# EAGLE schematic Indev v1 (EAGLE 6.3)
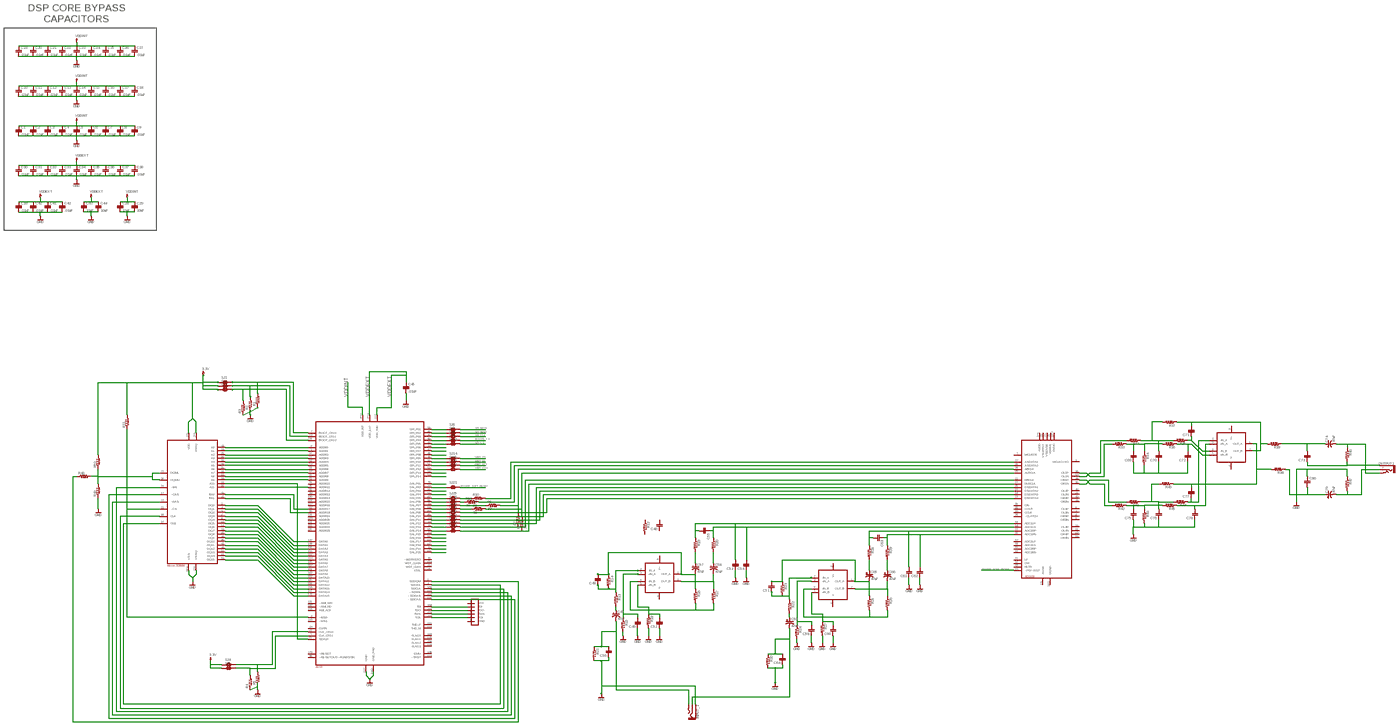
[diagram p0: schematic, sheet 1, overview]
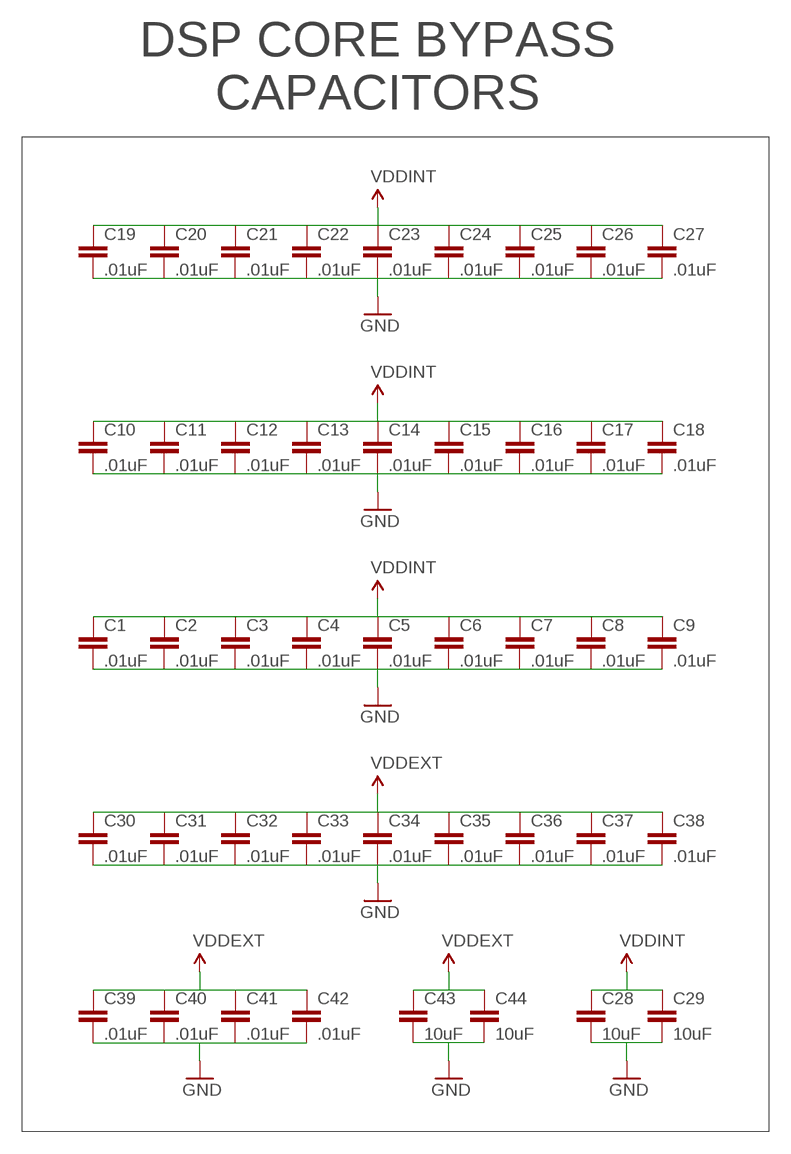
[diagram p1: schematic, sheet 1, part 1 of 4]
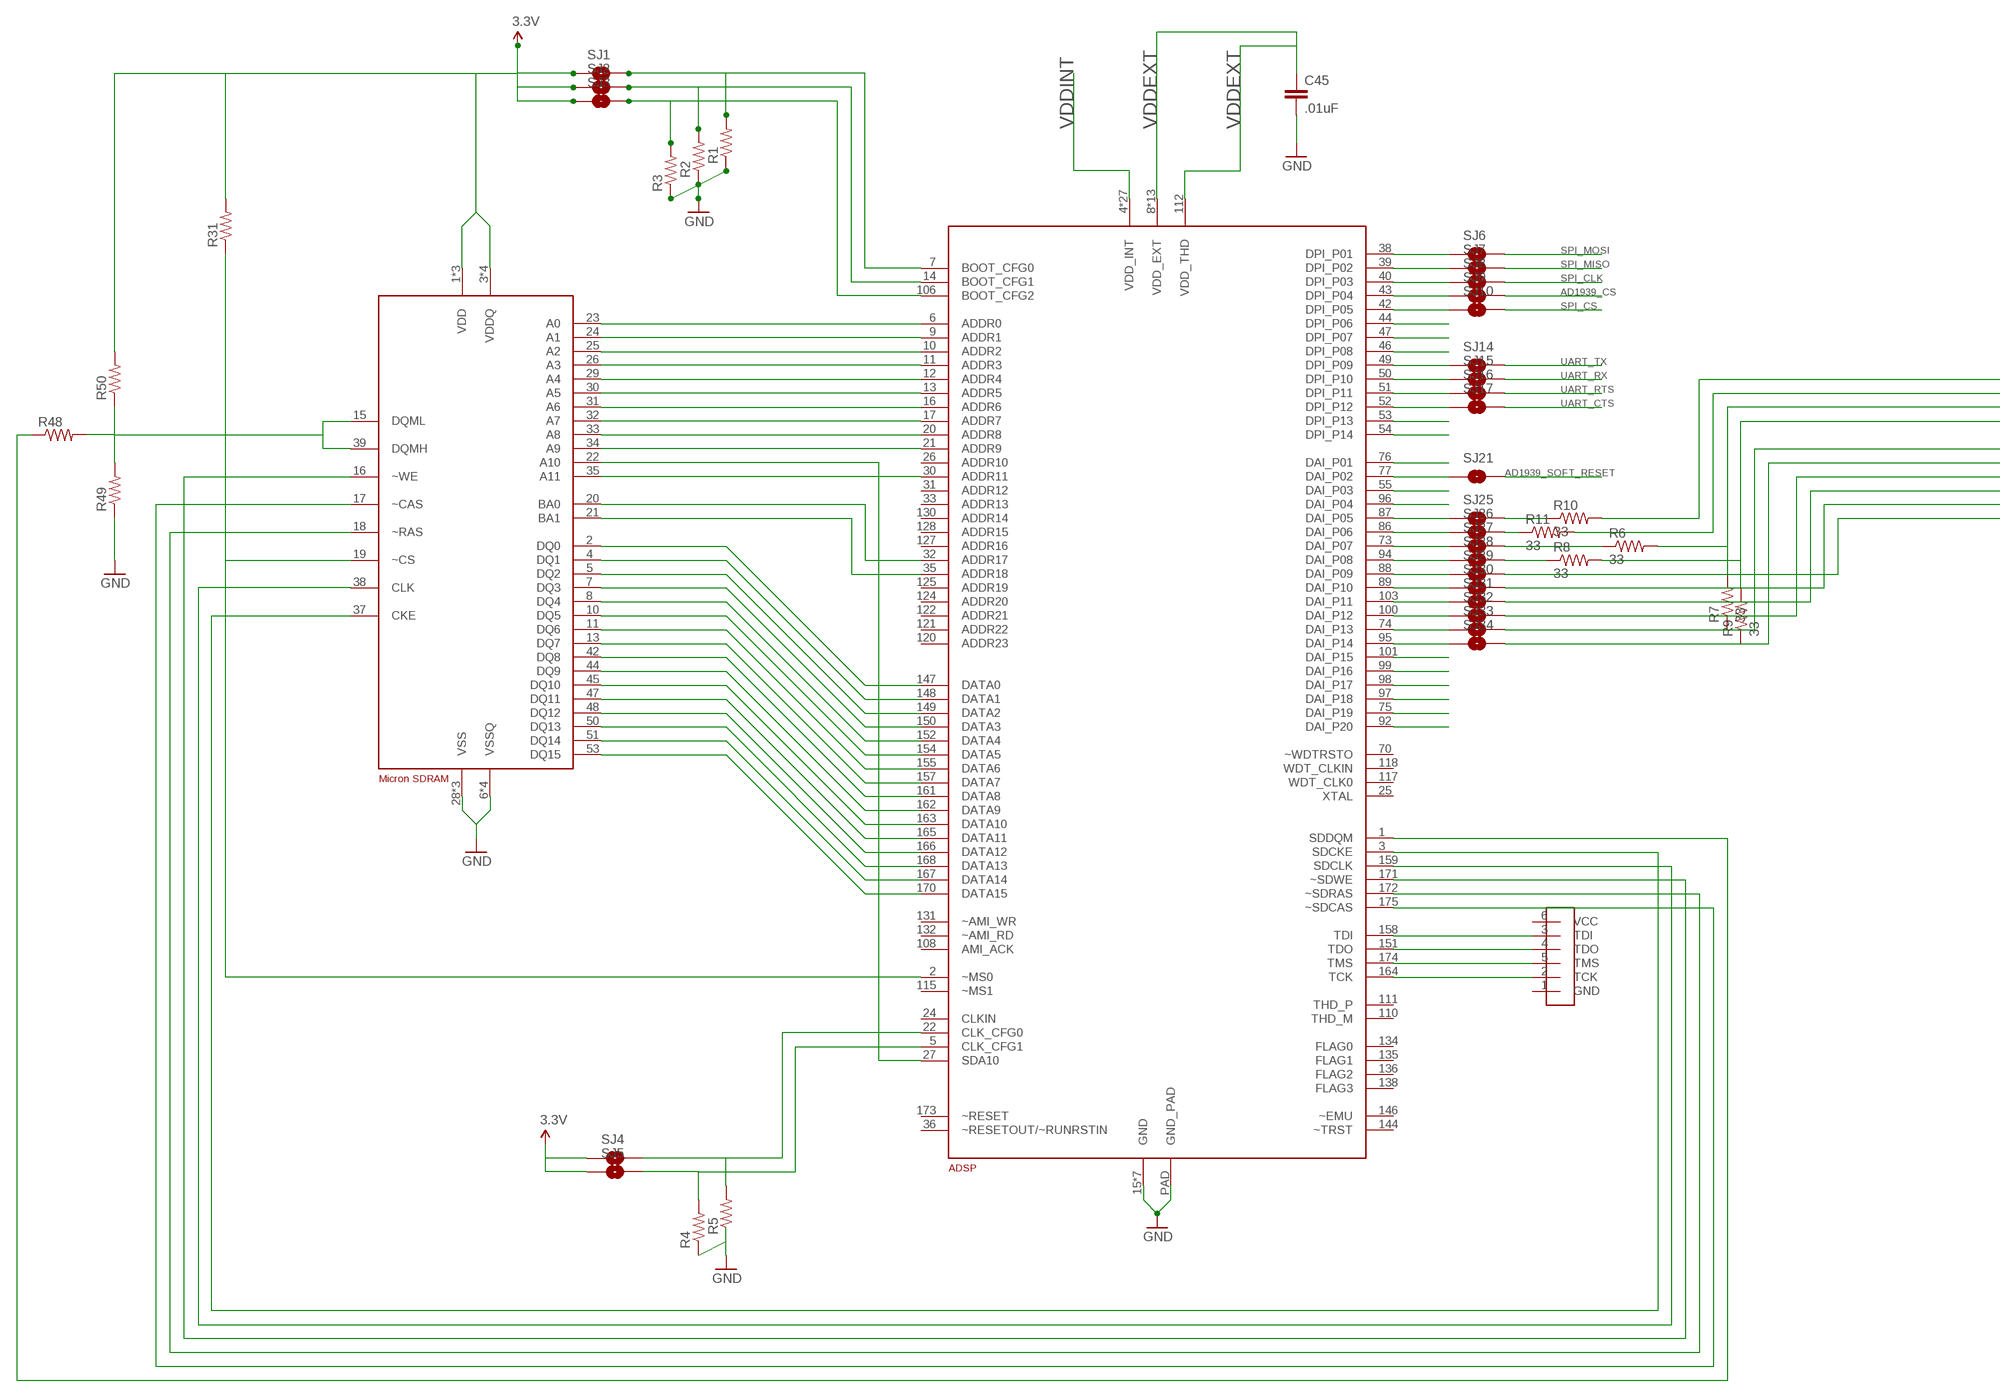
[diagram p2: schematic, sheet 1, part 2 of 4]
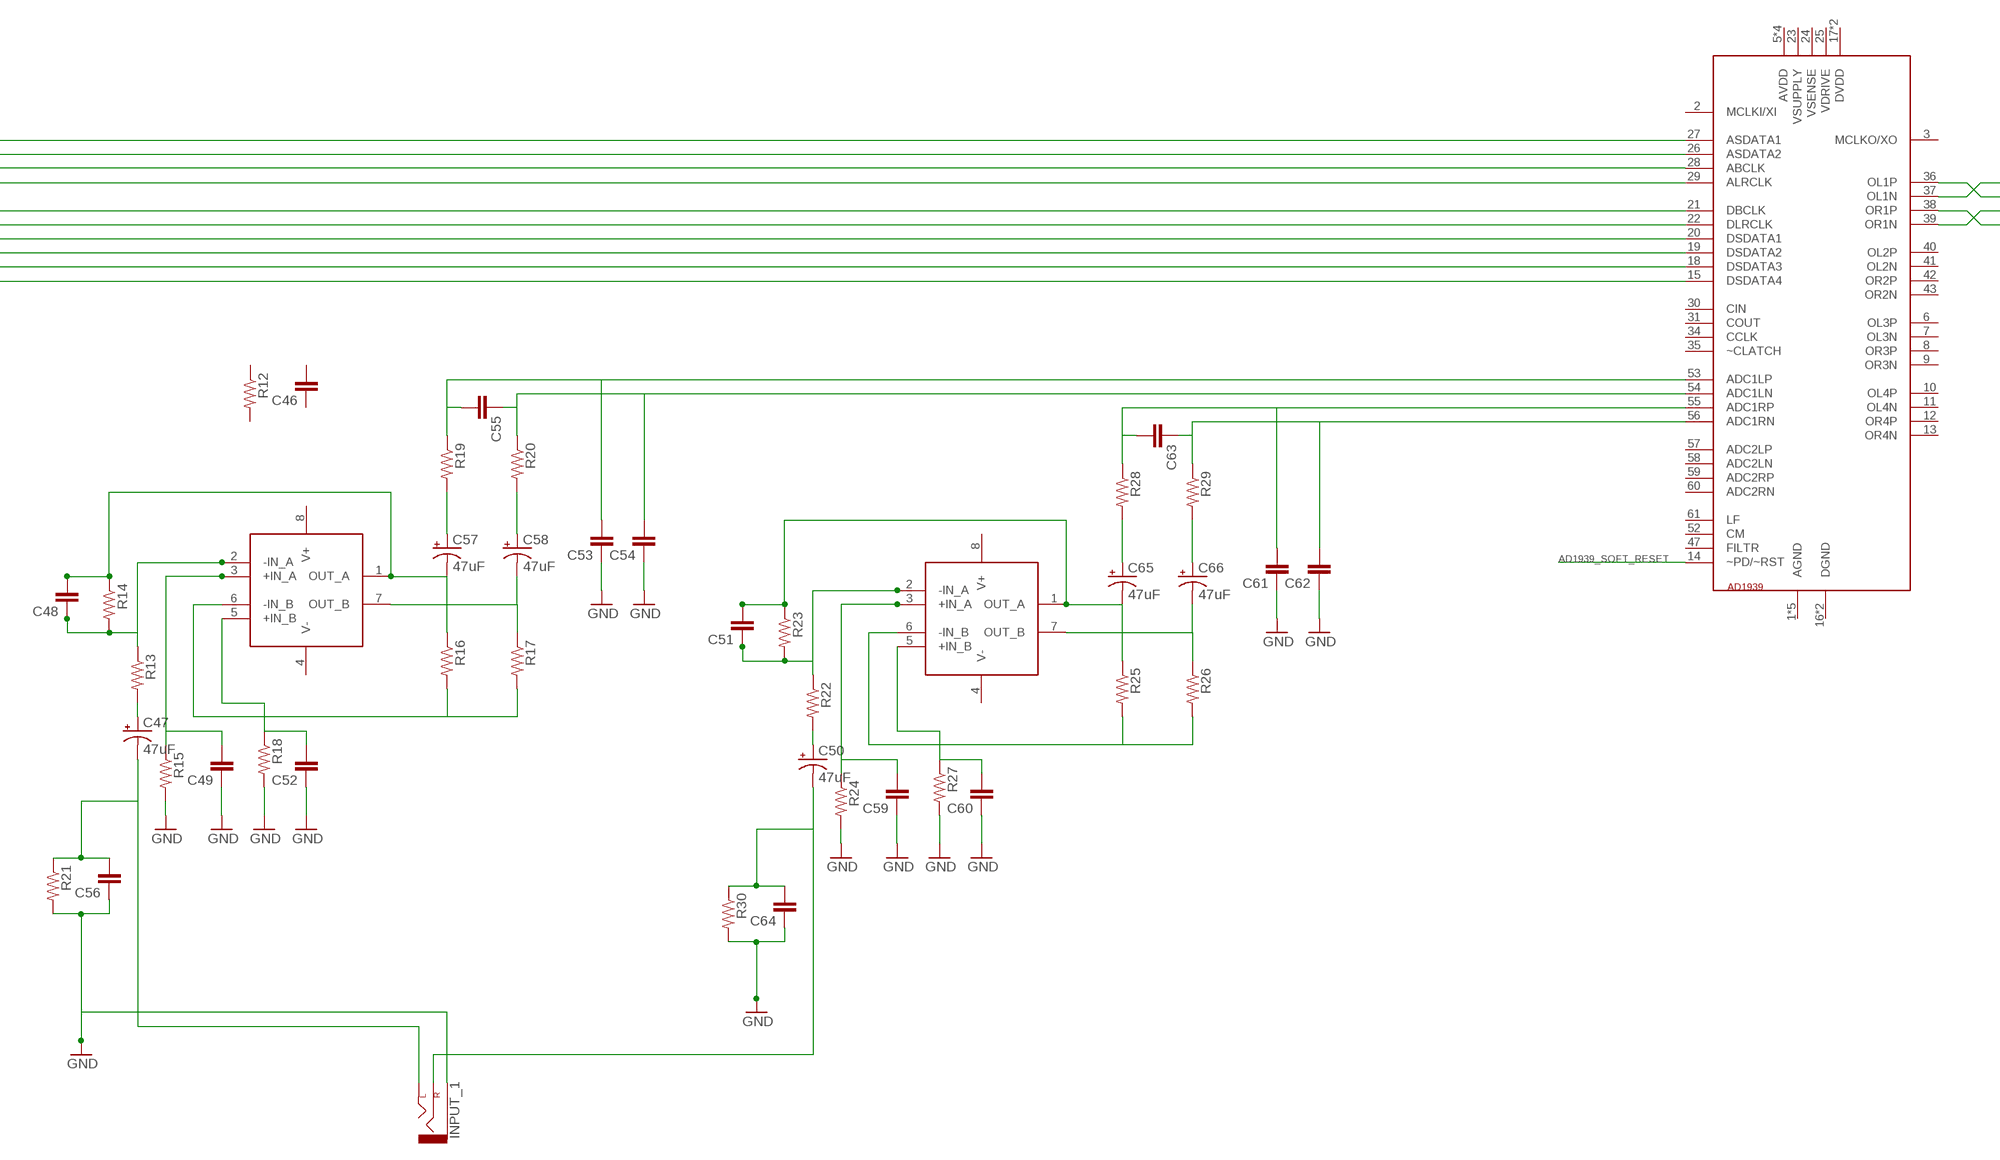
[diagram p3: schematic, sheet 1, part 3 of 4]
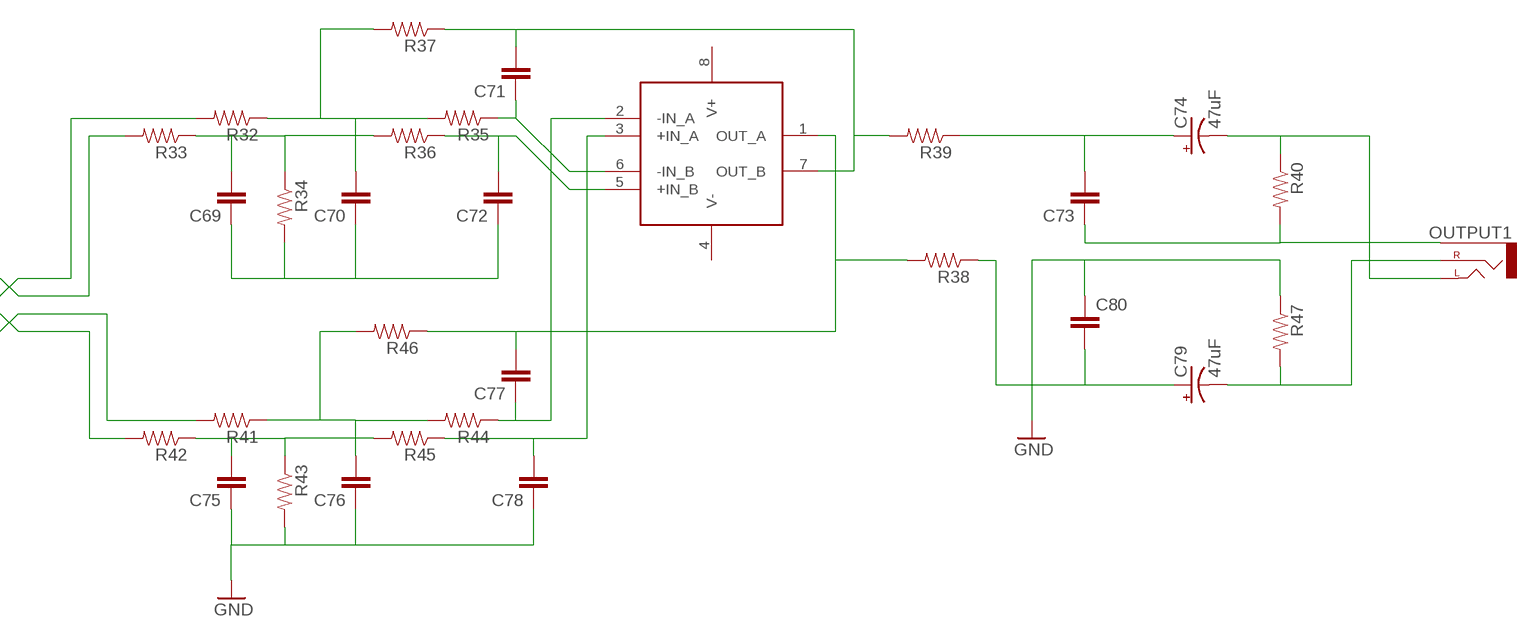
[diagram p4: schematic, sheet 1, part 4 of 4]

## Parts
C1  .01uF  CAP0402-CAP  [0402-CAP]
C2  .01uF  CAP0402-CAP  [0402-CAP]
C3  .01uF  CAP0402-CAP  [0402-CAP]
C4  .01uF  CAP0402-CAP  [0402-CAP]
C5  .01uF  CAP0402-CAP  [0402-CAP]
C6  .01uF  CAP0402-CAP  [0402-CAP]
C7  .01uF  CAP0402-CAP  [0402-CAP]
C8  .01uF  CAP0402-CAP  [0402-CAP]
C9  .01uF  CAP0402-CAP  [0402-CAP]
C10  .01uF  CAP0402-CAP  [0402-CAP]
C11  .01uF  CAP0402-CAP  [0402-CAP]
C12  .01uF  CAP0402-CAP  [0402-CAP]
C13  .01uF  CAP0402-CAP  [0402-CAP]
C14  .01uF  CAP0402-CAP  [0402-CAP]
C15  .01uF  CAP0402-CAP  [0402-CAP]
C16  .01uF  CAP0402-CAP  [0402-CAP]
C17  .01uF  CAP0402-CAP  [0402-CAP]
C18  .01uF  CAP0402-CAP  [0402-CAP]
C19  .01uF  CAP0402-CAP  [0402-CAP]
C20  .01uF  CAP0402-CAP  [0402-CAP]
C21  .01uF  CAP0402-CAP  [0402-CAP]
C22  .01uF  CAP0402-CAP  [0402-CAP]
C23  .01uF  CAP0402-CAP  [0402-CAP]
C24  .01uF  CAP0402-CAP  [0402-CAP]
C25  .01uF  CAP0402-CAP  [0402-CAP]
C26  .01uF  CAP0402-CAP  [0402-CAP]
C27  .01uF  CAP0402-CAP  [0402-CAP]
C28  10uF  CAP0805  [0805]
C29  10uF  CAP0805  [0805]
C30  .01uF  CAP0402-CAP  [0402-CAP]
C31  .01uF  CAP0402-CAP  [0402-CAP]
C32  .01uF  CAP0402-CAP  [0402-CAP]
C33  .01uF  CAP0402-CAP  [0402-CAP]
C34  .01uF  CAP0402-CAP  [0402-CAP]
C35  .01uF  CAP0402-CAP  [0402-CAP]
C36  .01uF  CAP0402-CAP  [0402-CAP]
C37  .01uF  CAP0402-CAP  [0402-CAP]
C38  .01uF  CAP0402-CAP  [0402-CAP]
C39  .01uF  CAP0402-CAP  [0402-CAP]
C40  .01uF  CAP0402-CAP  [0402-CAP]
C41  .01uF  CAP0402-CAP  [0402-CAP]
C42  .01uF  CAP0402-CAP  [0402-CAP]
C43  10uF  CAP0805  [0805]
C44  10uF  CAP0805  [0805]
C45  .01uF  CAP0402-CAP  [0402-CAP]
C46  CAP0402-CAP  [0402-CAP]
C47  47uF  CAP_POL3528  [EIA3528]
C48  CAP0402-CAP  [0402-CAP]
C49  CAP0402-CAP  [0402-CAP]
C50  47uF  CAP_POL3528  [EIA3528]
C51  CAP0402-CAP  [0402-CAP]
C52  CAP0402-CAP  [0402-CAP]
C53  CAP0402-CAP  [0402-CAP]
C54  CAP0402-CAP  [0402-CAP]
C55  CAP0402-CAP  [0402-CAP]
C56  CAP0402-CAP  [0402-CAP]
C57  47uF  CAP_POL3528  [EIA3528]
C58  47uF  CAP_POL3528  [EIA3528]
C59  CAP0402-CAP  [0402-CAP]
C60  CAP0402-CAP  [0402-CAP]
C61  CAP0402-CAP  [0402-CAP]
C62  CAP0402-CAP  [0402-CAP]
C63  CAP0402-CAP  [0402-CAP]
C64  CAP0402-CAP  [0402-CAP]
C65  47uF  CAP_POL3528  [EIA3528]
C66  47uF  CAP_POL3528  [EIA3528]
C69  CAP0402-CAP  [0402-CAP]
C70  CAP0402-CAP  [0402-CAP]
C71  CAP0402-CAP  [0402-CAP]
C72  CAP0402-CAP  [0402-CAP]
C73  CAP0402-CAP  [0402-CAP]
C74  47uF  CAP_POL3528  [EIA3528]
C75  CAP0402-CAP  [0402-CAP]
C76  CAP0402-CAP  [0402-CAP]
C77  CAP0402-CAP  [0402-CAP]
C78  CAP0402-CAP  [0402-CAP]
C79  47uF  CAP_POL3528  [EIA3528]
C80  CAP0402-CAP  [0402-CAP]
IN_LEFT_BUFF  OP275  [SO-8]
IN_RIGHT_BUFF  OP275  [SO-8]
INPUT_1  AUDIO-JACKSMD2  [AUDIO-JACK-3.5MM-SMD]
OUTPUT1  AUDIO-JACKSMD2  [AUDIO-JACK-3.5MM-SMD]
R1  RESISTOR0402-RES  [0402-RES]
R2  RESISTOR0402-RES  [0402-RES]
R3  RESISTOR0402-RES  [0402-RES]
R4  RESISTOR0402-RES  [0402-RES]
R5  RESISTOR0402-RES  [0402-RES]
R6  33  RESISTOR0402-RES  [0402-RES]
R7  33  RESISTOR0402-RES  [0402-RES]
R8  33  RESISTOR0402-RES  [0402-RES]
R9  33  RESISTOR0402-RES  [0402-RES]
R10  33  RESISTOR0402-RES  [0402-RES]
R11  33  RESISTOR0402-RES  [0402-RES]
R12  RESISTOR0402-RES  [0402-RES]
R13  RESISTOR0402-RES  [0402-RES]
R14  RESISTOR0402-RES  [0402-RES]
R15  RESISTOR0402-RES  [0402-RES]
R16  RESISTOR0402-RES  [0402-RES]
R17  RESISTOR0402-RES  [0402-RES]
R18  RESISTOR0402-RES  [0402-RES]
R19  RESISTOR0402-RES  [0402-RES]
R20  RESISTOR0402-RES  [0402-RES]
R21  RESISTOR0402-RES  [0402-RES]
R22  RESISTOR0402-RES  [0402-RES]
R23  RESISTOR0402-RES  [0402-RES]
R24  RESISTOR0402-RES  [0402-RES]
R25  RESISTOR0402-RES  [0402-RES]
R26  RESISTOR0402-RES  [0402-RES]
R27  RESISTOR0402-RES  [0402-RES]
R28  RESISTOR0402-RES  [0402-RES]
R29  RESISTOR0402-RES  [0402-RES]
R30  RESISTOR0402-RES  [0402-RES]
R31  RESISTOR0402-RES  [0402-RES]
R32  RESISTOR0402-RES  [0402-RES]
R33  RESISTOR0402-RES  [0402-RES]
R34  RESISTOR0402-RES  [0402-RES]
R35  RESISTOR0402-RES  [0402-RES]
R36  RESISTOR0402-RES  [0402-RES]
R37  RESISTOR0402-RES  [0402-RES]
R38  RESISTOR0402-RES  [0402-RES]
R39  RESISTOR0402-RES  [0402-RES]
R40  RESISTOR0402-RES  [0402-RES]
R41  RESISTOR0402-RES  [0402-RES]
R42  RESISTOR0402-RES  [0402-RES]
R43  RESISTOR0402-RES  [0402-RES]
R44  RESISTOR0402-RES  [0402-RES]
R45  RESISTOR0402-RES  [0402-RES]
R46  RESISTOR0402-RES  [0402-RES]
R47  RESISTOR0402-RES  [0402-RES]
R48  RESISTOR0402-RES  [0402-RES]
R49  RESISTOR0402-RES  [0402-RES]
R50  RESISTOR0402-RES  [0402-RES]
SJ1  SOLDERJUMPERNC2  [SJ_2S-NOTRACE]
SJ2  SOLDERJUMPERNC2  [SJ_2S-NOTRACE]
SJ3  SOLDERJUMPERNC2  [SJ_2S-NOTRACE]
SJ4  SOLDERJUMPERNC2  [SJ_2S-NOTRACE]
SJ5  SOLDERJUMPERNC2  [SJ_2S-NOTRACE]
SJ6  SOLDERJUMPERNC  [SJ_2S]
SJ7  SOLDERJUMPERNC  [SJ_2S]
SJ8  SOLDERJUMPERNC  [SJ_2S]
SJ9  SOLDERJUMPERNC  [SJ_2S]
SJ10  SOLDERJUMPERNC  [SJ_2S]
SJ14  SOLDERJUMPERNC  [SJ_2S]
SJ15  SOLDERJUMPERNC  [SJ_2S]
SJ16  SOLDERJUMPERNC  [SJ_2S]
SJ17  SOLDERJUMPERNC  [SJ_2S]
SJ21  SOLDERJUMPERNC  [SJ_2S]
SJ25  SOLDERJUMPERNC  [SJ_2S]
SJ26  SOLDERJUMPERNC  [SJ_2S]
SJ27  SOLDERJUMPERNC  [SJ_2S]
SJ28  SOLDERJUMPERNC  [SJ_2S]
SJ29  SOLDERJUMPERNC  [SJ_2S]
SJ30  SOLDERJUMPERNC  [SJ_2S]
SJ31  SOLDERJUMPERNC  [SJ_2S]
SJ32  SOLDERJUMPERNC  [SJ_2S]
SJ33  SOLDERJUMPERNC  [SJ_2S]
SJ34  SOLDERJUMPERNC  [SJ_2S]
U$1  ADSP-21483/6/7/9  [LQFP-176]
U$2  JTAG  [JTAG-FPC]
U$3  AD1939  [QFP64]
U$4  OP275  [SO-8]
U$7  MT48LC4M16A2  [TSOP-54]

## Nets
3.3V: R31.2 R50.2 SJ1.1 SJ2.1 SJ3.1 SJ4.1 SJ5.1 U$7.1(VDD) U$7.3(VDDQ) U$7.9(VDDQ) U$7.14(VDD) U$7.27(VDD) U$7.43(VDDQ) U$7.49(VDDQ)
ABCLK: R6.2 R7.2 U$3.28(ABCLK)
ABCLK_Z: R6.1 SJ27.2
AD1939_CS: SJ9.2
AD1939_SOFT_RESET: SJ21.2 U$3.14(~PD/~RST)
ADC1LN: C54.2 C55.1 R20.1 U$3.54(ADC1LN)
ADC1LP: C53.2 C55.2 R19.1 U$3.53(ADC1LP)
ADC1RN: C62.2 C63.1 R29.1 U$3.56(ADC1RN)
ADC1RP: C61.2 C63.2 R28.1 U$3.55(ADC1RP)
ALRCLK: R8.2 R9.2 U$3.29(ALRCLK)
ALRCLK_Z: R8.1 SJ28.2
ASDATA1: R10.2 U$3.27(ASDATA1)
ASDATA1_Z: R10.1 SJ25.2
ASDATA2: R11.2 U$3.26(ASDATA2)
ASDATA2_Z: R11.1 SJ26.2
DAI_P05: SJ25.1 U$1.87(DAI_P05)
DAI_P06: SJ26.1 U$1.86(DAI_P06)
DAI_P07: SJ27.1 U$1.73(DAI_P07)
DAI_P08: SJ28.1 U$1.94(DAI_P08)
DAI_P13: SJ33.1 U$1.74(DAI_P13)
DAI_P14: SJ34.1 U$1.95(DAI_P14)
DBCLK: R7.1 SJ33.2 U$3.21(DBCLK)
DLRCLK: R9.1 SJ34.2 U$3.22(DLRCLK)
GND: C1.2 C2.2 C3.2 C4.2 C5.2 C6.2 C7.2 C8.2 C9.2 C10.2 C11.2 C12.2 C13.2 C14.2 C15.2 C16.2 C17.2 C18.2 C19.2 C20.2 C21.2 C22.2 C23.2 C24.2 C25.2 C26.2 C27.2 C28.2 C29.2 C30.2 C31.2 C32.2 C33.2 C34.2 C35.2 C36.2 C37.2 C38.2 C39.2 C40.2 C41.2 C42.2 C43.2 C44.2 C45.2 C49.1 C52.1 C53.1 C54.1 C56.1 C59.1 C60.1 C61.1 C62.1 C64.1 C75.1 C76.1 C78.1 C80.1 INPUT_1.SLEEVE R1.1 R2.1 R3.1 R15.2 R18.2 R21.2 R24.2 R27.2 R30.2 R43.2 R47.1 R49.1 U$1.15(GND) U$1.109(GND) U$1.137(GND) U$1.139(GND) U$1.140(GND) U$1.142(GND) U$1.145(GND) U$1.PAD(GND_PAD) U$7.6(VSSQ) U$7.12(VSSQ) U$7.28(VSS) U$7.41(VSS) U$7.46(VSSQ) U$7.52(VSSQ) U$7.54(VSS)
IN_3P5_LEFT: C47.C(-) C56.2 INPUT_1.TIP(LEFT) R21.1
IN_3P5_RIGHT: C50.C(-) C64.2 INPUT_1.RING(RIGHT) R30.1
N$1: R1.2 SJ1.2 U$1.7(BOOT_CFG0)
N$2: R2.2 SJ2.2 U$1.14(BOOT_CFG1)
N$3: R3.2 SJ3.2 U$1.106(BOOT_CFG2)
N$4: U$1.158(TDI) U$2.3(TDI)
N$5: U$1.151(TDO) U$2.4(TDO)
N$6: U$1.174(TMS) U$2.5(TMS)
N$7: R5.2 SJ4.2 U$1.22(CLK_CFG0)
N$8: R4.1 R5.1
N$9: R4.2 SJ5.2 U$1.5(CLK_CFG1)
N$10: U$1.164(TCK) U$2.2(TCK)
N$11: SJ6.1 U$1.38(DPI_P01)
N$12: SJ7.1 U$1.39(DPI_P02)
N$13: SJ8.1 U$1.40(DPI_P03)
N$14: SJ9.1 U$1.43(DPI_P04)
N$15: SJ10.1 U$1.42(DPI_P05)
N$16: SJ14.1 U$1.49(DPI_P09)
N$17: SJ15.1 U$1.50(DPI_P10)
N$18: SJ16.1 U$1.51(DPI_P11)
N$19: SJ17.1 U$1.52(DPI_P12)
N$20: U$1.44(DPI_P06)
N$21: U$1.47(DPI_P07)
N$22: U$1.46(DPI_P08)
N$23: U$1.53(DPI_P13)
N$24: U$1.54(DPI_P14)
N$25: U$1.76(DAI_P01)
N$26: SJ21.1 U$1.77(DAI_P02)
N$27: U$1.55(DAI_P03)
N$28: U$1.96(DAI_P04)
N$29: SJ29.2 U$3.15(DSDATA4)
N$30: SJ30.2 U$3.18(DSDATA3)
N$31: SJ31.2 U$3.19(DSDATA2)
N$32: SJ32.2 U$3.20(DSDATA1)
N$33: SJ29.1 U$1.88(DAI_P09)
N$34: SJ30.1 U$1.89(DAI_P10)
N$35: SJ31.1 U$1.103(DAI_P11)
N$36: SJ32.1 U$1.100(DAI_P12)
N$38: C47.A(+) R13.2
N$39: U$1.101(DAI_P15)
N$40: U$1.99(DAI_P16)
N$41: U$1.98(DAI_P17)
N$42: U$1.97(DAI_P18)
N$43: U$1.75(DAI_P19)
N$44: U$1.92(DAI_P20)
N$45: C48.1 IN_LEFT_BUFF.2(-IN_A) R13.1 R14.2
N$46: C48.2 C57.C(-) IN_LEFT_BUFF.1(OUT_A) R14.1 R16.1
N$47: C49.2 IN_LEFT_BUFF.3(+IN_A) R15.1
N$48: IN_LEFT_BUFF.6(-IN_B) R16.2 R17.2
N$49: C52.2 IN_LEFT_BUFF.5(+IN_B) R18.1
N$50: C57.A(+) R19.2
N$51: C58.A(+) R20.2
N$52: C58.C(-) IN_LEFT_BUFF.7(OUT_B) R17.1
N$55: C50.A(+) R22.2
N$56: C51.1 IN_RIGHT_BUFF.2(-IN_A) R22.1 R23.2
N$57: C51.2 C65.C(-) IN_RIGHT_BUFF.1(OUT_A) R23.1 R25.1
N$58: C59.2 IN_RIGHT_BUFF.3(+IN_A) R24.1
N$59: IN_RIGHT_BUFF.6(-IN_B) R25.2 R26.2
N$60: C60.2 IN_RIGHT_BUFF.5(+IN_B) R27.1
N$61: C66.C(-) IN_RIGHT_BUFF.7(OUT_B) R26.1
N$62: C65.A(+) R28.2
N$63: C66.A(+) R29.2
N$69: C69.2 R33.1 R34.1 R36.2
N$70: C69.1 C70.1 C72.1 R34.2
N$71: C70.2 R32.1 R35.2 R37.2
N$72: C71.2 R37.1 R39.2 U$4.7(OUT_B)
N$73: C71.1 R35.1 U$4.6(-IN_B)
N$74: C72.2 R36.1 U$4.5(+IN_B)
N$76: C73.2 C74.A(+) R39.1
N$77: C74.C(-) OUTPUT1.TIP(LEFT) R40.1
N$78: C73.1 OUTPUT1.SLEEVE R40.2
N$80: C75.2 R42.1 R43.1 R45.2
N$81: U$1.6(ADDR0) U$7.23(A0)
N$82: C76.2 R41.1 R44.2 R46.2
N$83: C77.1 R44.1 U$4.2(-IN_A)
N$84: C77.2 R38.2 R46.1 U$4.1(OUT_A)
N$85: C78.2 R45.1 U$4.3(+IN_A)
N$86: C79.A(+) C80.2 R38.1
N$87: U$1.9(ADDR1) U$7.24(A1)
N$88: C79.C(-) OUTPUT1.RING(RIGHT) R47.2
N$89: U$1.10(ADDR2) U$7.25(A2)
N$90: U$1.11(ADDR3) U$7.26(A3)
N$91: U$1.12(ADDR4) U$7.29(A4)
N$92: U$1.13(ADDR5) U$7.30(A5)
N$93: U$1.16(ADDR6) U$7.31(A6)
N$94: U$1.17(ADDR7) U$7.32(A7)
N$95: U$1.20(ADDR8) U$7.33(A8)
N$96: U$1.21(ADDR9) U$7.34(A9)
N$97: U$1.27(SDA10) U$7.22(A10)
N$98: U$1.30(ADDR11) U$7.35(A11)
N$99: U$1.32(ADDR17) U$7.20(BA0)
N$100: U$1.35(ADDR18) U$7.21(BA1)
N$101: R31.1 U$1.2(~MS0) U$7.19(~CS)
N$102: U$1.3(SDCKE) U$7.37(CKE)
N$103: U$1.159(SDCLK) U$7.38(CLK)
N$104: U$1.172(~SDRAS) U$7.18(~RAS)
N$105: U$1.171(~SDWE) U$7.16(~WE)
N$106: U$1.175(~SDCAS) U$7.17(~CAS)
N$107: R48.1 U$1.1(SDDQM)
N$108: R48.2 R49.2 R50.1 U$7.15(DQML) U$7.39(DQMH)
N$109: U$1.147(DATA0) U$7.2(DQ0)
N$110: U$1.148(DATA1) U$7.4(DQ1)
N$111: U$1.149(DATA2) U$7.5(DQ2)
N$112: U$1.150(DATA3) U$7.7(DQ3)
N$113: U$1.152(DATA4) U$7.8(DQ4)
N$114: U$1.154(DATA5) U$7.10(DQ5)
N$115: U$1.155(DATA6) U$7.11(DQ6)
N$116: U$1.157(DATA7) U$7.13(DQ7)
N$117: U$1.161(DATA8) U$7.42(DQ8)
N$118: U$1.162(DATA9) U$7.44(DQ9)
N$119: U$1.163(DATA10) U$7.45(DQ10)
N$120: U$1.165(DATA11) U$7.47(DQ11)
N$121: U$1.166(DATA12) U$7.48(DQ12)
N$122: U$1.168(DATA13) U$7.50(DQ13)
N$123: U$1.167(DATA14) U$7.51(DQ14)
N$124: U$1.170(DATA15) U$7.53(DQ15)
OL1N: R32.2 U$3.37(OL1N)
OL1P: R33.2 U$3.36(OL1P)
OR1N: R41.2 U$3.39(OR1N)
OR1P: R42.2 U$3.38(OR1P)
SPI_CLK: SJ8.2
SPI_CS: SJ10.2
SPI_MISO: SJ7.2
SPI_MOSI: SJ6.2
UART_CTS: SJ17.2
UART_RTS: SJ16.2
UART_RX: SJ15.2
UART_TX: SJ14.2
VCCINT: C1.1 C2.1 C3.1 C4.1 C5.1 C6.1 C7.1 C8.1 C9.1 C10.1 C11.1 C12.1 C13.1 C14.1 C15.1 C16.1 C17.1 C18.1 ; supply symbol labelled VDDINT
VDDEXT: C30.1 C31.1 C32.1 C33.1 C34.1 C35.1 C36.1 C37.1 C38.1 C39.1 C40.1 C41.1 C42.1 C43.1 C44.1 C45.1 U$1.8(VDD_EXT) U$1.28(VDD_EXT) U$1.45(VDD_EXT) U$1.57(VDD_EXT) U$1.72(VDD_EXT) U$1.84(VDD_EXT) U$1.91(VDD_EXT) U$1.104(VDD_EXT) U$1.112(VDD_THD) U$1.119(VDD_EXT) U$1.126(VDD_EXT) U$1.141(VDD_EXT) U$1.153(VDD_EXT) U$1.160(VDD_EXT)
VDDINT: C19.1 C20.1 C21.1 C22.1 C23.1 C24.1 C25.1 C26.1 C27.1 C28.1 C29.1 U$1.4(VDD_INT) U$1.23(VDD_INT) U$1.29(VDD_INT) U$1.34(VDD_INT) U$1.37(VDD_INT) U$1.41(VDD_INT) U$1.48(VDD_INT) U$1.62(VDD_INT) U$1.65(VDD_INT) U$1.68(VDD_INT) U$1.78(VDD_INT) U$1.85(VDD_INT) U$1.90(VDD_INT) U$1.93(VDD_INT) U$1.102(VDD_INT) U$1.105(VDD_INT) U$1.107(VDD_INT) U$1.113(VDD_INT) U$1.114(VDD_INT) U$1.116(VDD_INT) U$1.123(VDD_INT) U$1.129(VDD_INT) U$1.133(VDD_INT) U$1.143(VDD_INT) U$1.156(VDD_INT) U$1.169(VDD_INT) U$1.176(VDD_INT)
Unconnected: C46.1 C46.2 IN_LEFT_BUFF.4(V-) IN_LEFT_BUFF.8(V+) IN_RIGHT_BUFF.4(V-) IN_RIGHT_BUFF.8(V+) R12.1 R12.2 U$1.24(CLKIN) U$1.25(XTAL) U$1.26(ADDR10) U$1.31(ADDR12) U$1.33(ADDR13) U$1.36(~RESETOUT/~RUNRSTIN) U$1.70(~WDTRSTO) U$1.108(AMI_ACK) U$1.110(THD_M) U$1.111(THD_P) U$1.115(~MS1) U$1.117(WDT_CLK0) U$1.118(WDT_CLKIN) U$1.120(ADDR23) U$1.121(ADDR22) U$1.122(ADDR21) U$1.124(ADDR20) U$1.125(ADDR19) U$1.127(ADDR16) U$1.128(ADDR15) U$1.130(ADDR14) U$1.131(~AMI_WR) U$1.132(~AMI_RD) U$1.134(FLAG0) U$1.135(FLAG1) U$1.136(FLAG2) U$1.138(FLAG3) U$1.144(~TRST) U$1.146(~EMU) U$1.173(~RESET) U$2.1(GND) U$2.6(VCC) U$3.1(AGND) U$3.2(MCLKI/XI) U$3.3(MCLKO/XO) U$3.4(AGND) U$3.5(AVDD) U$3.6(OL3P) U$3.7(OL3N) U$3.8(OR3P) U$3.9(OR3N) U$3.10(OL4P) U$3.11(OL4N) U$3.12(OR4P) U$3.13(OR4N) U$3.16(DGND) U$3.17(DVDD) U$3.23(VSUPPLY) U$3.24(VSENSE) U$3.25(VDRIVE) U$3.30(CIN) U$3.31(COUT) U$3.32(DVDD) U$3.33(DGND) U$3.34(CCLK) U$3.35(~CLATCH) U$3.40(OL2P) U$3.41(OL2N) U$3.42(OR2P) U$3.43(OR2N) U$3.44(AGND) U$3.45(AVDD) U$3.46(AGND) U$3.47(FILTR) U$3.48(AGND) U$3.51(AVDD) U$3.52(CM) U$3.57(ADC2LP) U$3.58(ADC2LN) U$3.59(ADC2RP) U$3.60(ADC2RN) U$3.61(LF) U$3.62(AVDD) U$4.4(V-) U$4.8(V+)

## Notes on the sheet
- DSP CORE BYPASS
  CAPACITORS

## Library data of the parts
C1-C46 C48 C49 C51-C56 C59-C64 C69-C73 C75-C78 C80 = 1x05smd:CAP: Capacitor Standard 0603 ceramic capacitor, and 0.1" leaded capacitor.
C47 C50 C57 C58 C65 C66 C74 C79 = 1x05smd:CAP_POL: Capacitor Polarized These are standard SMD and PTH capacitors. Normally 10uF, 47uF, and 100uF in electrolytic and tantalum varieties. Always verify the external diameter of the through hole cap, it varies with capacity, voltage, and manufacturer. The EIA devices should be standard.
IN_LEFT_BUFF IN_RIGHT_BUFF U$4 = Strutz Electronic Industries:OP275
INPUT_1 OUTPUT1 = SparkFun-Connectors:AUDIO-JACK: 3.5mm Audio Jack Simple 3.5mm common PCB mount audio jack. SKU: PRT-08032
R1-R50 = 1x05smd:RESISTOR: Resistor Basic schematic elements and footprints for 0603, 1206, and PTH 1/10th watt (small) resistors.
SJ1-SJ10 SJ14-SJ17 SJ21 SJ25-SJ34 = 1x05smd:SOLDERJUMPER: Solder Jumper Standard SMD solder jumper. Used to automate production. Two varients : Normally Open and Normally Closed are the same, but have different paste layers. NC will have a large amount of paste and should jumper during reflow.
U$1 = Strutz Electronic Industries:ADSP-21483/6/7/9
U$2 = Strutz Electronic Industries:JTAG
U$3 = Strutz Electronic Industries:AD1939
U$7 = Strutz Electronic Industries:MT48LC4M16A2